# EAGLE design cia2piggy2 (EAGLE 9.2.1)
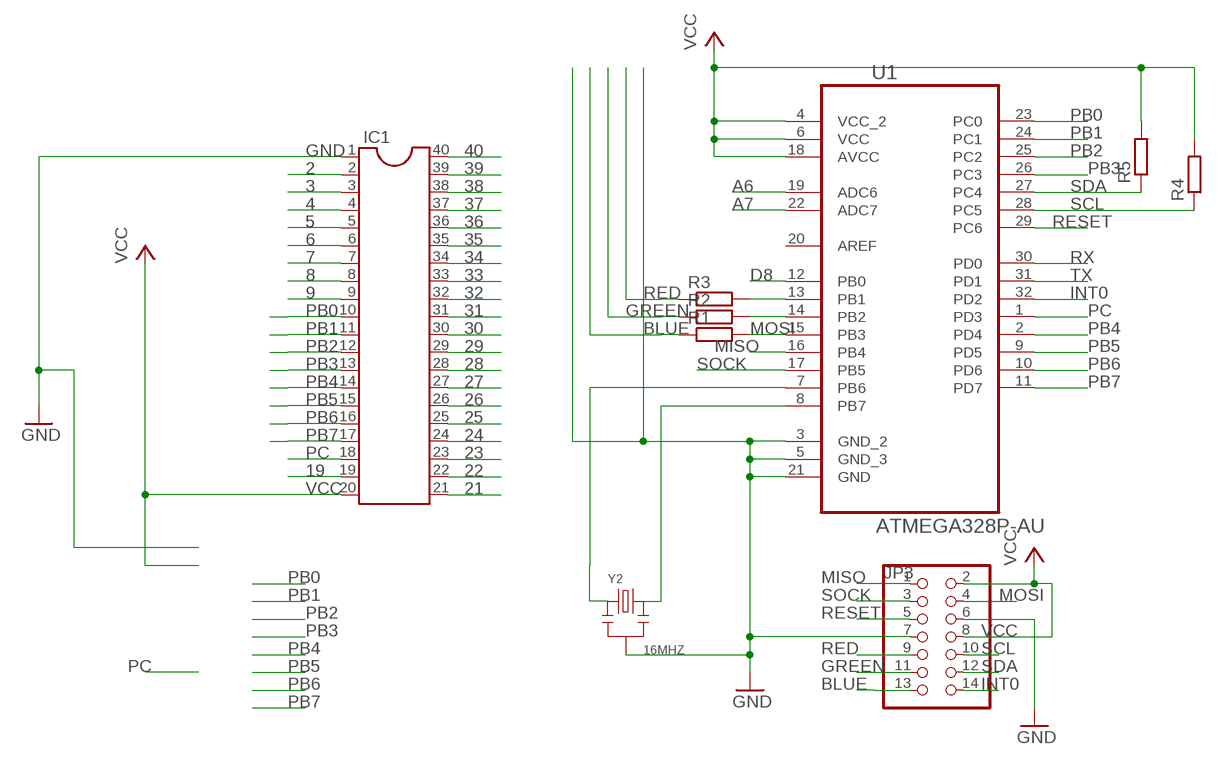
[diagram p0: schematic, sheet 1]

## Parts
IC1  DIL40  [DIL40]
JP3  PINHD-2X7  [2X07]
R1  R-EU_M0805  [M0805]
R2  R-EU_M0805  [M0805]
R3  R-EU_M0805  [M0805]
R4  R-EU_M0805  [M0805]
R5  R-EU_M0805  [M0805]
U1  ATMEGA328P-AU  [QFP80P900X900X120-32N]
Y2  16MHZ  SMD-CRYSTAL-8MHZ--0.3%-150R(3P-3.6X1.3MM)  [X3-SMD-3.6X1.3X0.8MM]

## Nets
2: IC1.2
3: IC1.3
4: IC1.4
5: IC1.5
6: IC1.6
7: IC1.7
8: IC1.8
9: IC1.9
19: IC1.19
21: IC1.21
22: IC1.22
23: IC1.23
24: IC1.24
25: IC1.25
26: IC1.26
27: IC1.27
28: IC1.28
29: IC1.29
30: IC1.30
31: IC1.31
32: IC1.32
33: IC1.33
34: IC1.34
35: IC1.35
36: IC1.36
37: IC1.37
38: IC1.38
39: IC1.39
40: IC1.40
A6: U1.19(ADC6)
A7: U1.22(ADC7)
BLUE: JP3.13 R1.1
D8: U1.12(PB0)
GND: IC1.1 JP3.6 JP3.7 U1.3(GND_2) U1.5(GND_3) U1.21(GND) Y2.2
GREEN: JP3.11 R2.1
INT0: JP3.14 U1.32(PD2)
MISO: JP3.1 U1.16(PB4)
MOSI: JP3.4 R1.2 U1.15(PB3)
N$1: R3.2 U1.13(PB1)
N$2: R2.2 U1.14(PB2)
N$3: U1.7(PB6) Y2.1
N$4: U1.8(PB7) Y2.3
PB0: IC1.10 U1.23(PC0)
PB1: IC1.11 U1.24(PC1)
PB2: IC1.12 U1.25(PC2)
PB3: IC1.13 U1.26(PC3)
PB4: IC1.14 U1.2(PD4)
PB5: IC1.15 U1.9(PD5)
PB6: IC1.16 U1.10(PD6)
PB7: IC1.17 U1.11(PD7)
PC: IC1.18 U1.1(PD3)
RED: JP3.9 R3.1
RESET: JP3.5 U1.29(PC6)
RX: U1.30(PD0)
SCL: JP3.10 R4.1 U1.28(PC5)
SDA: JP3.12 R5.1 U1.27(PC4)
SOCK: JP3.3 U1.17(PB5)
TX: U1.31(PD1)
VCC: IC1.20 JP3.2 JP3.8 R4.2 R5.2 U1.4(VCC_2) U1.6(VCC) U1.18(AVCC)
Unconnected: U1.20(AREF)

## Library data of the parts
IC1 = ube:DIL40: Dual In Line
JP3 = pinhead:PINHD-2X7: PIN HEADER
R1-R5 = resistor:R-EU_: RESISTOR, European symbol
U1 = Atmel_By_element14_Batch_1-00:ATMEGA328P-AU: 8-bit Microcontroller with In-System Programmable Flash; MPN: ATMEGA328P-AU; OC_FARNELL: 1715486; OC_NEWARK: 14R4631; PACKAGE: TQFP-32; SUPPLIER: Atmel
Y2 = Seeed-Crystal Oscillator:SMD-CRYSTAL-8MHZ--0.3%-150R(3P-3.6X1.3MM): 306010053; VALUE: 8MHZ

## Net classes
0 default: width 0.152 mm

## Board
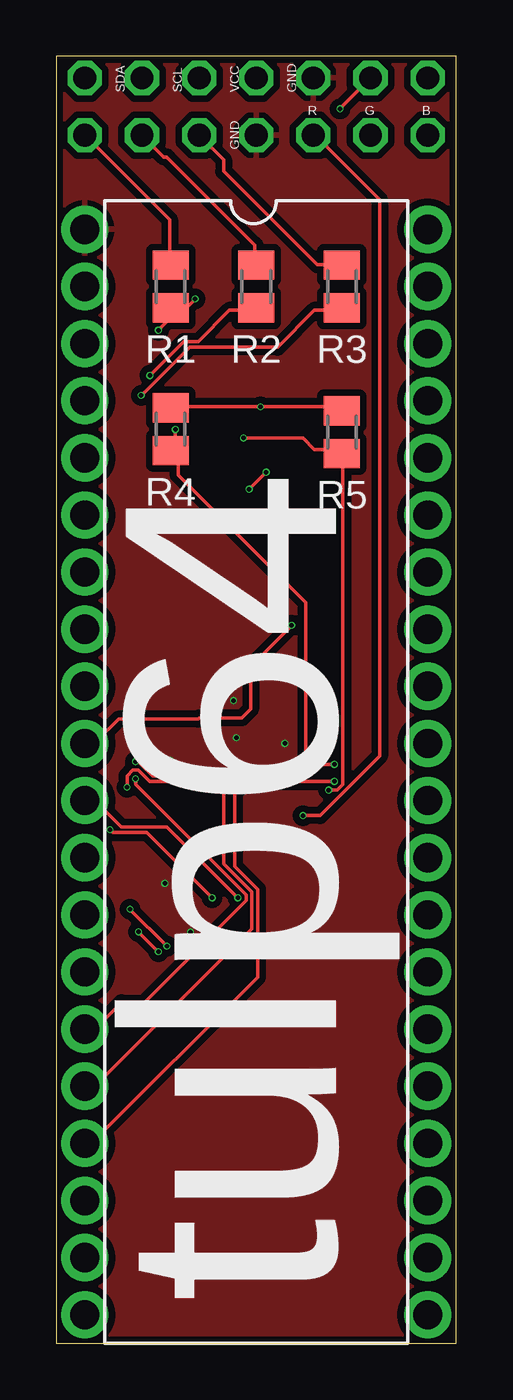
[diagram p1: board, top side]
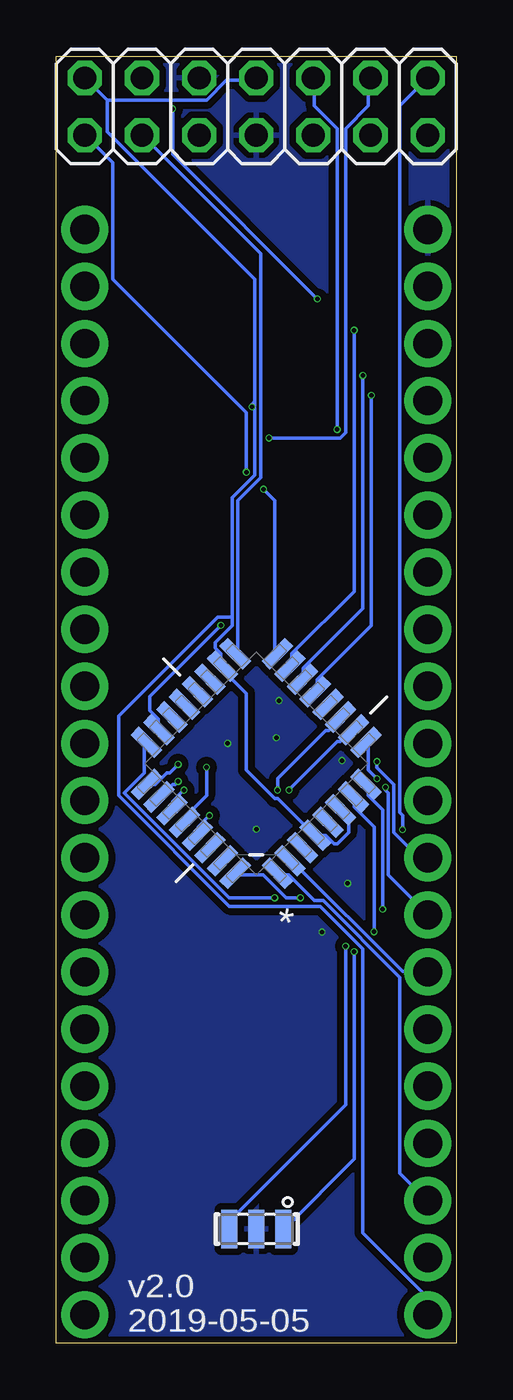
[diagram p2: board, bottom side, seen from below]

Size 17.78 x 57.23 mm. Coordinates in mm from the lower left corner, seen from the top.
Outline: 0,0 17.78,0 17.78,57.23 0,57.23 0,0
Copper layers (1*16): Top 0.035mm / dielectric 1.5mm / Bottom 0.035mm
Design rules "aisler_2_layer": minimum track width 0.1mm, minimum drill 0.2mm, track to track 0.1mm, track to pad 0.1mm, pad to pad 0.1mm, via to via 0.1mm, smd to smd 0.1mm, copper to edge 0.2mm, drill to drill 0.21mm, minimum pad ring 0.25mm, minimum via ring 0.05mm, stop-mask expansion 0mil, vias tented up to drill 0mil, thermal gap 10mil

### Footprints (pad centres in the part's own frame; a part is rotated, then mirrored left to right if it is on the bottom)
DIL40 = drill 1.3 pad 2.1: 1 -24.13,-7.62; 2 -21.59,-7.62; 3 -19.05,-7.62; 4 -16.51,-7.62; 5 -13.97,-7.62; 6 -11.43,-7.62; 7 -8.89,-7.62; 8 -6.35,-7.62; 9 -3.81,-7.62; 10 -1.27,-7.62; 11 1.27,-7.62; 12 3.81,-7.62; 13 6.35,-7.62; 14 8.89,-7.62; 15 11.43,-7.62; 16 13.97,-7.62; 17 16.51,-7.62; 18 19.05,-7.62; 19 21.59,-7.62; 20 24.13,-7.62; 21 24.13,7.62; 22 21.59,7.62; 23 19.05,7.62; 24 16.51,7.62; 25 13.97,7.62; 26 11.43,7.62; 27 8.89,7.62; 28 6.35,7.62; 29 3.81,7.62; 30 1.27,7.62; 31 -1.27,7.62; 32 -3.81,7.62; 33 -6.35,7.62; 34 -8.89,7.62; 35 -11.43,7.62; 36 -13.97,7.62; 37 -16.51,7.62; 38 -19.05,7.62; 39 -21.59,7.62; 40 -24.13,7.62
2X07 = drill 1.016 octagon: 1 -7.62,-1.27; 2 -7.62,1.27; 3 -5.08,-1.27; 4 -5.08,1.27; 5 -2.54,-1.27; 6 -2.54,1.27; 7 0,-1.27; 8 0,1.27; 9 2.54,-1.27; 10 2.54,1.27; 11 5.08,-1.27; 12 5.08,1.27; 13 7.62,-1.27; 14 7.62,1.27
M0805 = smd 1.3 x 1.6: 1 -0.95,0; 2 0.95,0
QFP80P900X900X120-32N = smd 1.473 x 0.508: 1 -4.115,2.794; 2 -4.115,2.007; 3 -4.115,1.194; 4 -4.115,0.406; 5 -4.115,-0.406; 6 -4.115,-1.194; 7 -4.115,-2.007; 8 -4.115,-2.794; 17 4.115,-2.794; 18 4.115,-2.007; 19 4.115,-1.194; 20 4.115,-0.406; 21 4.115,0.406; 22 4.115,1.194; 23 4.115,2.007; 24 4.115,2.794 | smd 0.508 x 1.473: 9 -2.794,-4.115; 10 -2.007,-4.115; 11 -1.194,-4.115; 12 -0.406,-4.115; 13 0.406,-4.115; 14 1.194,-4.115; 15 2.007,-4.115; 16 2.794,-4.115; 25 2.794,4.115; 26 2.007,4.115; 27 1.194,4.115; 28 0.406,4.115; 29 -0.406,4.115; 30 -1.194,4.115; 31 -2.007,4.115; 32 -2.794,4.115
X3-SMD-3.6X1.3X0.8MM = smd 0.7 x 1.7: 1 -1.2,0; 2 0,0; 3 1.2,0

### Placement (x,y rotation side)
IC1  8.89,25.4 270 top
JP3  8.89,54.99 0 bottom
R1  5.08,46.99 270 top
R2  8.89,46.99 270 top
R3  12.7,46.99 270 top
R4  5.08,40.64 90 top
R5  12.7,40.51 90 top
U1  8.89,25.78 135 bottom
Y2  8.89,5.08 180 bottom

### Tracks (layer width: path | path; a pad name or v marks a point on that pad's centre or on a via)
BLUE
  Top 0.152: R1.1 5.04,47.95 5.04,49.97 1.38,53.63 JP3.13
GND  (via drill 0.2)
  other vias: 7.87,28.57 10.16,26.67 8,26.92 8.89,22.86 5.08,25.91 4.83,20.45 5.97,18.29
  pour Top (isolate 0.305): -2.54,58.42 24.13,58.42 24.13,-3.81 -2.54,-3.81
  pour Bottom (isolate 0.305): -3.81,58.42 22.86,58.42 22.86,-8.89 -3.81,-8.89
GREEN
  Top 0.152: R2.1 8.83,47.95 8.83,48.83 4.91,52.74 4.79,52.74 3.9,53.63 JP3.11
INT0  (via drill 0.2)
  Top 0.152: v6.93,19.8 4.03,22.71 2.52,22.71 v2.39,22.83
  Bottom 0.152: v6.93,19.8 7.56,19.8 8.57,20.82 9.71,20.82 U1.32 | v2.39,22.83 2.39,23.46 2.52,23.59 2.52,55.01 1.38,56.15 JP3.14
MISO  (via drill 0.2)
  Top 0.152: v9.33,38.73 v8.57,37.98
  Bottom 0.152: v8.57,37.98 8.07,37.47 8.07,30.79 U1.16 | v9.33,38.73 9.33,41.39 15.26,47.32 15.26,52.49 16.4,53.63 JP3.1
MOSI  (via drill 0.2)
  Top 0.152: v4.54,45.04 5.04,45.55 5.04,45.93 R1.2 5.17,46.05 5.8,46.05 v6.18,46.43 | v12.61,54.89 13.87,56.15 JP3.4
  Bottom 0.152: v4.54,45.04 4.54,33.43 7.31,30.66 7.31,30.15 U1.15 | v12.61,54.89 12.61,52.87 v6.18,46.43
N$1  (via drill 0.2)
  Top 0.152: v3.78,42.14 5.92,44.29 9.84,44.29 11.48,45.93 12.61,45.93 R3.2
  Bottom 0.152: v3.78,42.14 3.78,31.92 6.18,29.52 6.18,29.02 U1.13
N$2  (via drill 0.2)
  Top 0.152: v4.16,43.03 5.67,44.54 6.3,44.54 7.69,45.93 8.83,45.93 R2.2
  Bottom 0.152: v4.16,43.03 4.16,32.68 6.81,30.03 6.81,29.65 U1.14
N$3  (via drill 0.2)
  Top 0.152: v4.54,17.41 v3.65,18.29
  Bottom 0.152: v3.65,18.29 3.65,22.96 4.54,23.84 4.54,24.22 U1.7 | v4.54,17.41 4.54,8.2 7.56,5.17 Y2.1
N$4  (via drill 0.2)
  Top 0.152: v4.91,17.66 v3.27,19.3
  Bottom 0.152: v3.27,19.3 3.27,23.72 3.9,24.35 3.9,24.73 U1.8 | v4.91,17.66 4.91,10.59 10.09,5.42 10.09,5.17 Y2.3
PB0  (via drill 0.2)
  Top 0.152: IC1.10 1.38,26.75 1.76,26.75 2.77,27.76 6.3,27.76 6.36,27.81 8.26,27.81 8.64,28.19 8.64,30.09 v10.47,31.92
  Bottom 0.152: v10.47,31.92 13.62,28.77 13.62,28.14 13.24,27.76 13.24,27.38 U1.23
PB1  (via drill 0.2)
  Top 0.152: v8.07,19.8 4.91,22.96 2.9,22.96 1.76,24.1 1.38,24.1 IC1.11
  Bottom 0.152: v8.07,19.8 10.09,19.8 14.76,24.48 13.87,25.36 13.87,26.62 U1.24
PB2  (via drill 0.2)
  Top 0.152: v12.36,25.74 11.73,25.74 11.22,25.23 4.28,25.23 3.65,25.86 v3.53,25.86
  Bottom 0.152: v12.36,25.74 12.74,25.36 12.86,25.36 13.37,24.85 13.75,24.85 U1.25 | v3.53,25.86 3.53,25.61 2.77,24.85 2.77,22.71 1.76,21.7 1.38,21.7 IC1.12
PB3  (via drill 0.2)
  Top 0.152: v12.36,24.98 4.16,24.98 3.65,25.48 3.4,25.48 3.15,25.23 v3.15,24.73
  Bottom 0.152: v12.36,24.98 12.49,24.85 12.61,24.85 13.12,24.35 U1.26 | v3.15,24.73 3.15,24.6 3.02,24.48 3.02,20.82 1.38,19.17 IC1.13
PB4
  Bottom 0.152: U1.2 7.31,21.45 2.39,16.52 1.38,16.52 IC1.14
PB5  (via drill 0.2)
  Top 0.152: v3.53,25.11 3.53,24.85 8.45,19.93 8.45,19.68 3.9,15.14 2.9,15.14 1.76,14 1.38,14 IC1.15
  Bottom 0.152: v3.53,25.11 3.9,25.48 3.9,26.62 U1.9
PB6  (via drill 0.2)
  Top 0.152: v7.44,24.6 7.44,21.32 8.7,20.06 8.7,18.42 1.76,11.48 1.38,11.48 IC1.16
  Bottom 0.152: v7.44,24.6 5.29,26.75 5.17,26.75 4.66,27.25 U1.10
PB7  (via drill 0.2)
  Top 0.152: v7.94,24.6 7.94,21.19 8.95,20.18 8.95,16.27 1.63,8.95 1.38,8.95 IC1.17
  Bottom 0.152: v7.94,24.6 7.94,25.11 5.8,27.25 5.67,27.25 5.17,27.76 U1.11
PC
  Bottom 0.152: U1.1 7.94,20.82 7.44,20.82 6.3,19.68 5.92,19.68 2.52,16.27 2.52,7.56 1.38,6.43 IC1.18
RED
  Top 0.152: R3.1 12.61,47.95 11.6,47.95 7.44,52.11 7.44,52.62 6.43,53.63 JP3.9
RESET  (via drill 0.2)
  Top 0.152: v10.97,23.46 11.73,23.46 14.38,26.12 14.38,50.85 11.48,53.75 JP3.5
  Bottom 0.152: v10.97,23.46 11.48,22.96 11.48,22.71 U1.29
SCL  (via drill 0.2)
  Top 0.152: v11.1,25.61 11.1,32.93 5.42,38.61 5.42,39.37 5.17,39.62 R4.1 5.17,39.74 5.29,39.87 v5.29,40.63
  Bottom 0.152: v11.1,25.61 11.1,24.35 11.98,23.46 11.98,23.21 U1.28 | v5.29,40.63 5.29,54.01 6.3,55.01 6.3,56.15 JP3.10
SDA  (via drill 0.2)
  Top 0.152: v12.11,24.6 12.49,24.6 12.74,24.85 12.74,39.49 R5.1 12.61,39.62 12.49,39.74 11.48,39.74 10.97,40.25 v8.32,40.25
  Bottom 0.152: v12.11,24.6 12.61,24.1 12.61,23.72 U1.27 | v8.32,40.25 5.17,40.25 4.91,40.5 4.91,54.01 3.9,55.01 3.9,56.15 JP3.12
SOCK
  Bottom 0.152: U1.17 9.71,30.79 9.71,37.47 8.7,38.48 8.7,48.45 13.87,53.63 JP3.3
VCC  (via drill 0.2)
  Top 0.152: R4.2 5.17,41.64 v9.08,41.64 12.49,41.64 12.61,41.51 R5.2
  Bottom 0.152: U1.6 5.04,23.59 4.79,23.34 4.79,22.71 5.29,22.2 5.42,22.2 5.8,22.58 6.18,22.58 U1.4 6.3,22.71 6.68,23.09 6.81,23.09 7.94,24.22 8.07,24.22 9.33,25.48 9.33,28.89 10.47,30.03 U1.18 10.47,30.15 10.47,30.66 10.72,30.91 10.72,31.16 9.96,31.92 9.96,32.3 | 9.96,32.3 9.96,37.6 8.95,38.61 8.95,41.89 | 8.95,41.89 8.95,47.32 15.52,53.88 15.52,55.27 | 15.52,55.27 16.4,56.15 JP3.2 | 15.52,55.27 11.1,55.27 10.21,56.15 8.95,56.15 JP3.8 | v9.08,41.64 9.08,41.76 8.95,41.89 | 9.96,32.3 10.59,32.3 15.01,27.88 15.01,24.35 10.09,19.43 6.05,19.43 4.16,17.53 4.16,4.91 1.38,2.14 1.38,1.38 IC1.20

### Text on the board
tPlace: SDA | SCL | VCC | GND | R | G | B | GND | tulp64
bPlace: v2.0 / 2019-05-05